# EAGLE design icsp (EAGLE 7.0.0)
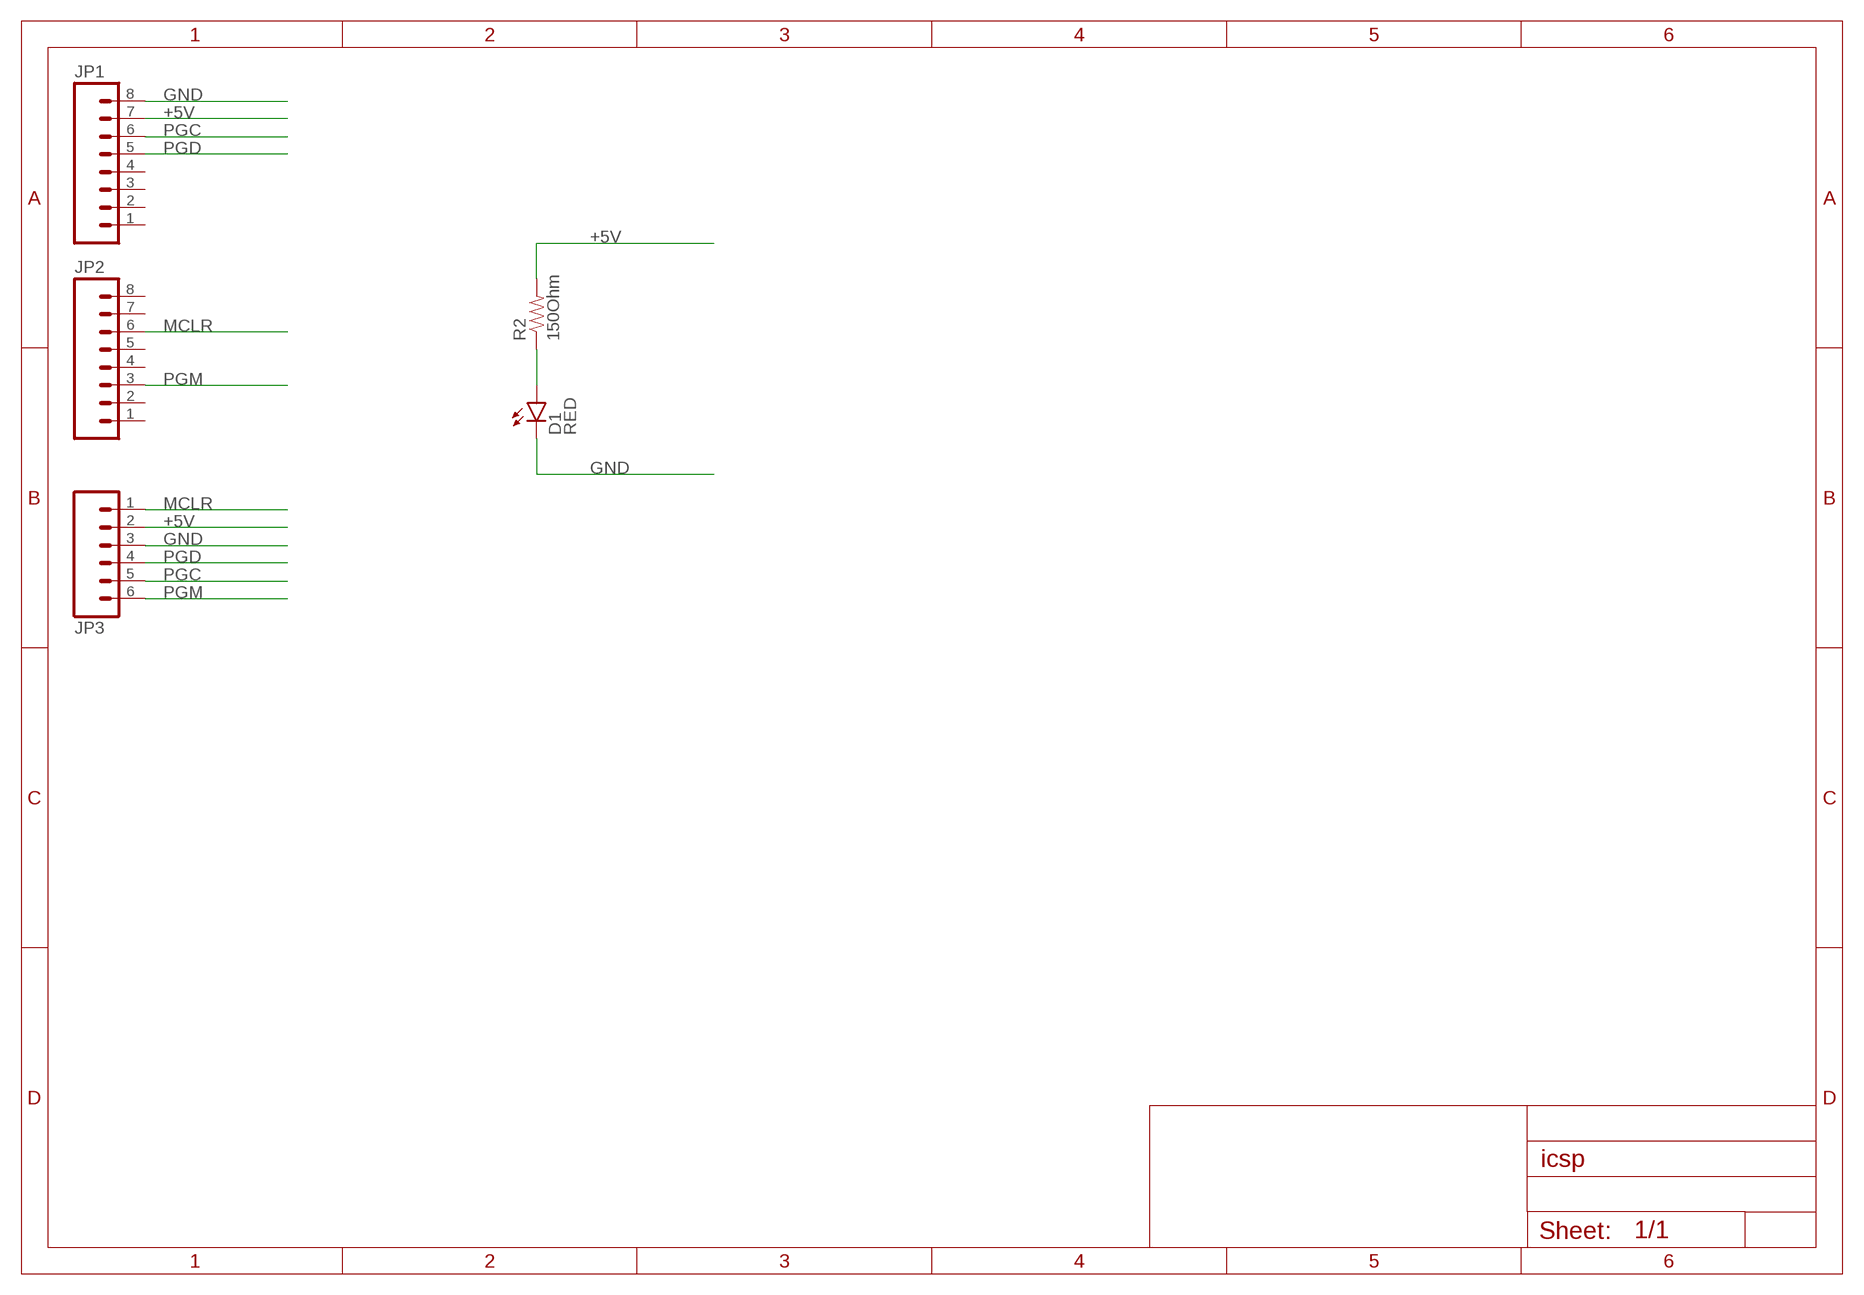
[diagram p0: schematic, sheet 1]

## Parts
D1  RED  LED-RED0603  [LED-0603]
JP1  M081X08  [1X08]
JP2  M081X08  [1X08]
JP3  M06SIP_LOCK  [1X06-SIP_LOCK]
R2  150Ohm  RESISTOR0402-RES  [0402-RES]

## Nets
+5V: JP1.7 JP3.2 R2.2
GND: D1.C JP1.8 JP3.3
MCLR: JP2.6 JP3.1
N$1: D1.A R2.1
PGC: JP1.6 JP3.5
PGD: JP1.5 JP3.4
PGM: JP2.3 JP3.6
Unconnected: JP1.1 JP1.2 JP1.3 JP1.4 JP2.1 JP2.2 JP2.4 JP2.5 JP2.7 JP2.8

## Library data of the parts
D1 = SparkFun-LED:LED-RED: Assorted Red LEDs LilyPad 1206- DIO-09912 1206- DIO-00809 0603- DIO-00819; PROD_ID: DIO-00819
JP1 JP2 = SparkFun-Connectors:M08: Header 8 Standard 8-pin 0.1" header. Use with straight break away headers (SKU : PRT-00116), right angle break away headers (PRT-00553), swiss pins (PRT-00743), machine pins (PRT-00117), and female headers (PRT-00115).
JP3 = SparkFun-Connectors:M06: Header 6 Standard 6-pin 0.1" header. Use with straight break away headers (SKU : PRT-00116), right angle break away headers (PRT-00553), swiss pins (PRT-00743), machine pins (PRT-00117), and female headers (PRT-00115). Molex polarized connector foot print use with SKU : PRT-08094 with associated crimp pins and housings. NOTES ON THE VARIANTS LOCK and LOCK_LONGPADS... This footprint was designed to help hold the alignment of a through-hole component (i.e. 6-pin header) while soldering it into place. You may notice that each hole has been shifted either up or down by 0.005 of an inch from it's more standard position (which is a perfectly straight line). This slight alteration caused the pins (the squares in the middle) to touch the edges of the holes. Because they are alternating, it causes a "brace" to hold the component in place. 0.005 has proven to be the perfect amount of "off-center" position when using our standard breakaway headers. Although looks a little odd when you look at the bare footprint, once you have a header in there, the alteration is very hard to notice. Also,if you push a header all the way into place, it is covered up entirely on the bottom side. This idea of altering the position of holes to aid alignment will be further integrated into the Sparkfun Library for other footprints. It can help hold any component with 3 or more connection pins.
R2 = SparkFun-Passives:RESISTOR: Resistor Basic schematic elements and footprints for 0603, 1206, and PTH resistors.

## Board
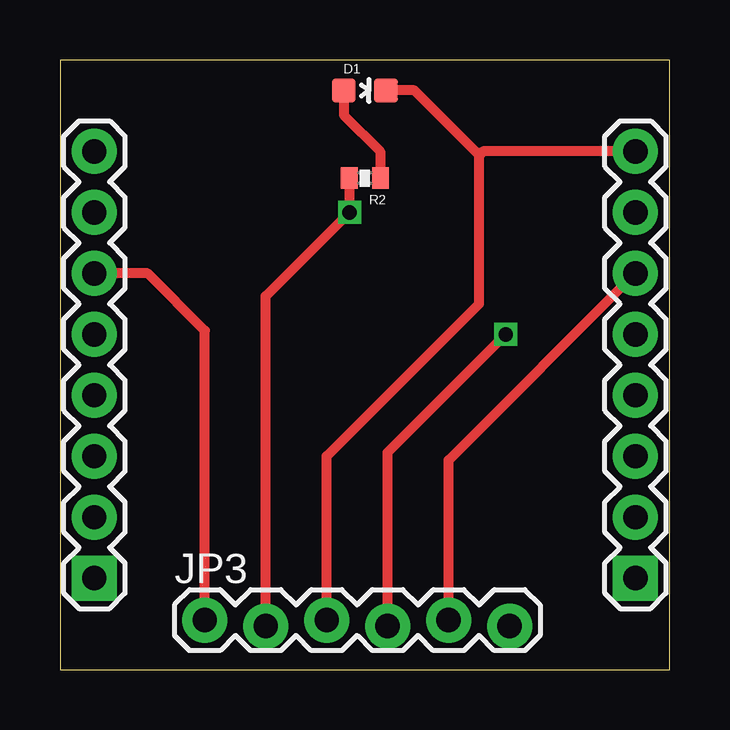
[diagram p1: board, top side]
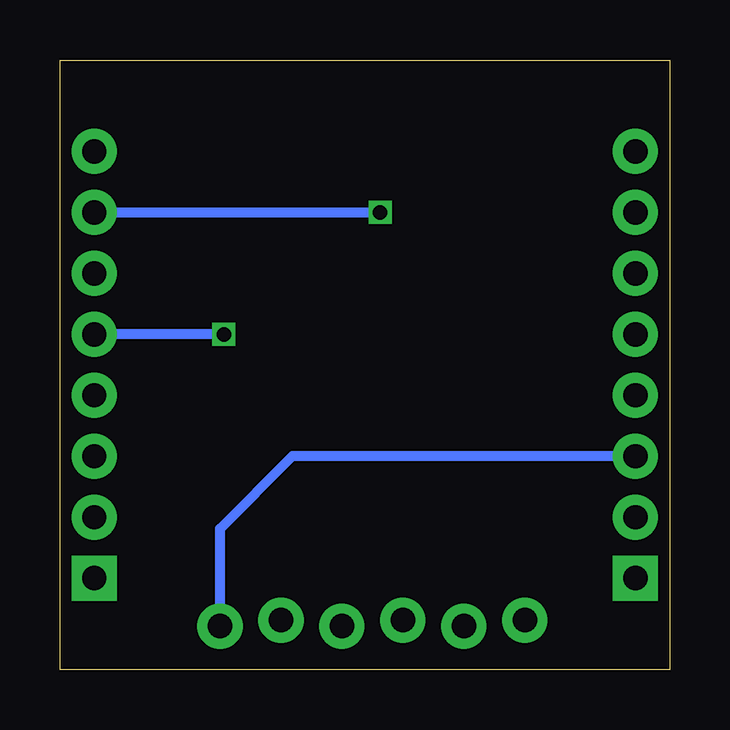
[diagram p2: board, bottom side, seen from below]

Size 25.4 x 25.4 mm. Coordinates in mm from the lower left corner, seen from the top.
Outline: 0,0 25.4,0 25.4,25.4 0,25.4 0,0
Copper layers (1*16): Top 0.0356mm / dielectric 1.5011mm / Bottom 0.0356mm
Design rules "LaenPCBOrder": minimum track width 6mil, minimum drill 13mil, track to track 6mil, track to pad 6mil, pad to pad 6mil, via to via 6mil, smd to smd 6mil, copper to edge 15mil, drill to drill 6mil, minimum pad ring 7mil, minimum via ring 7mil, stop-mask expansion 3mil, vias tented up to drill 0mil, thermal gap 10mil

### Footprints (pad centres in the part's own frame; a part is rotated, then mirrored left to right if it is on the bottom)
LED-0603 = smd 1 x 1: A 0,-0.877; C 0,0.877
1X08 = drill 1.016 pad 1.88 square: 1 0,0 | drill 1.016 pad 1.88: 2 2.54,0; 3 5.08,0; 4 7.62,0; 5 10.16,0; 6 12.7,0; 7 15.24,0; 8 17.78,0
1X06-SIP_LOCK = drill 1.016 pad 1.88: 1 0,0; 2 2.54,-0.254; 3 5.08,0; 4 7.62,-0.254; 5 10.16,0; 6 12.7,-0.254
0402-RES = smd 0.7 x 0.9: 1 -0.65,0; 2 0.65,0

### Placement (x,y rotation side)
D1  12.7,24.13 270 top
JP1  23.97,3.81 90 top
JP2  1.43,3.81 90 top
JP3  6.03,2.06 0 top
R2  12.7,20.48 180 top

### Tracks (layer width: path | path; a pad name or v marks a point on that pad's centre or on a via)
+5V  (via drill 0.6)
  Top 0.406: R2.2 12.06,20.46 v12.06,19.05 8.57,15.56 JP3.2
  Bottom 0.406: JP1.7 v12.06,19.05
GND
  Top 0.406: JP3.3 11.11,8.89 17.46,15.24 17.46,21.43 | 17.46,21.43 14.76,24.13 D1.C | JP1.8 17.62,21.59 17.46,21.43
MCLR
  Top 0.406: JP3.1 6.03,14.13 3.65,16.51 JP2.6
N$1
  Top 0.406: D1.A 11.82,23.1 13.34,21.59 13.34,20.49 R2.1
PGC
  Top 0.406: JP3.5 16.19,8.73 JP1.6
PGD  (via drill 0.6)
  Top 0.406: JP3.4 13.65,9.05 v18.57,13.97
  Bottom 0.406: v18.57,13.97 JP1.5
PGM
  Bottom 0.406: JP3.6 18.73,5.87 15.72,8.89 JP2.3